# EAGLE design MicroMod_Processor_Board-nRF52840 (EAGLE 9.5.2)
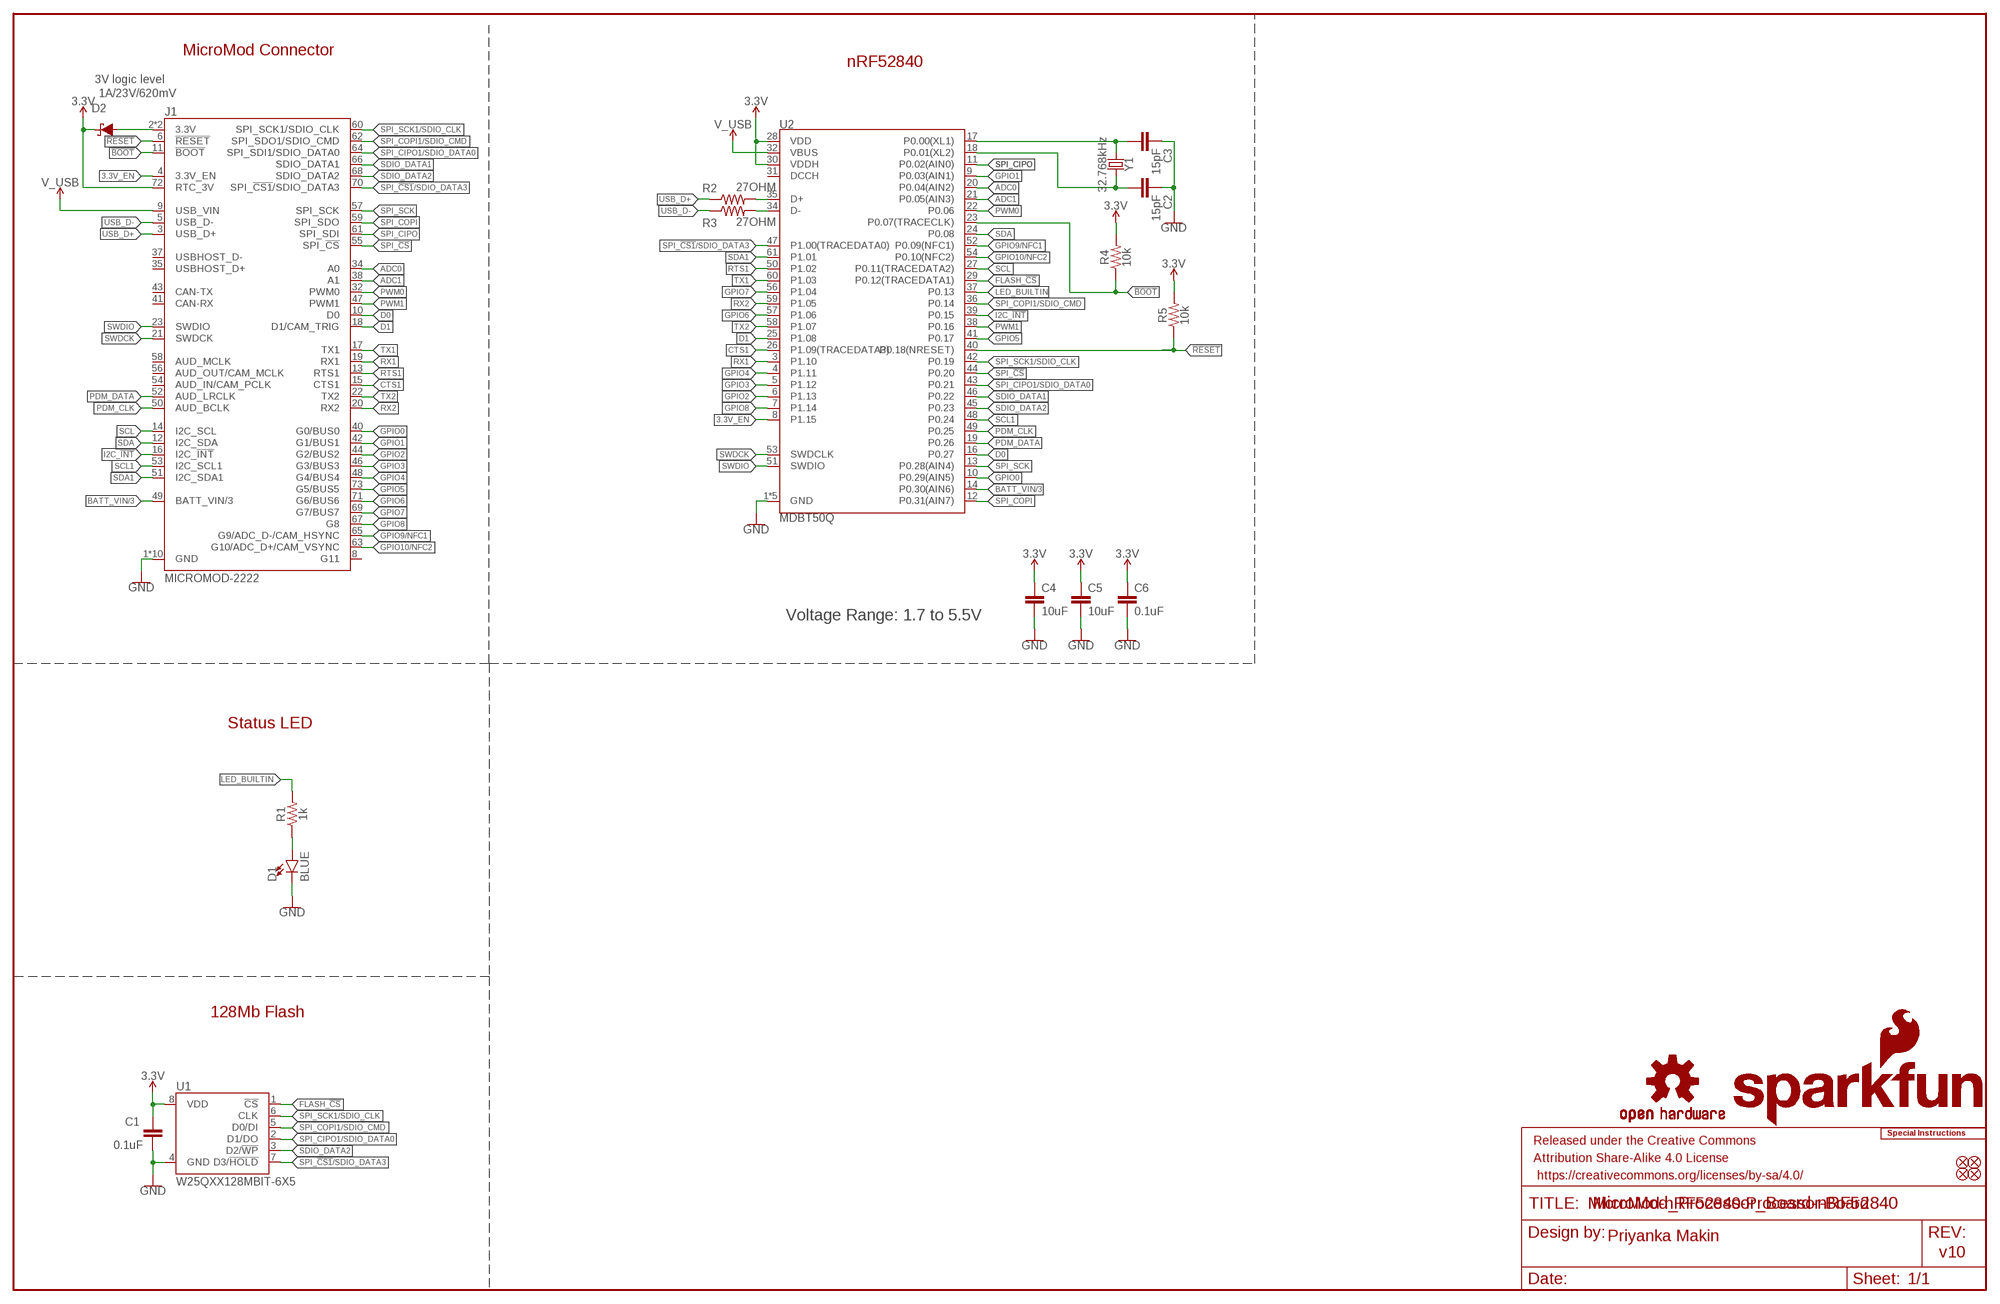
[diagram p0: schematic, sheet 1]

## Parts
C1  0.1uF  0.1UF-0402T-16V-10%  [0402-TIGHT]
C2  15pF  15PF-0402T-50V-5%  [0402-TIGHT]
C3  15pF  15PF-0402T-50V-5%  [0402-TIGHT]
C4  10uF  10UF-0402T-6.3V-20%  [0402-TIGHT]
C5  10uF  10UF-0402T-6.3V-20%  [0402-TIGHT]
C6  0.1uF  0.1UF-0402T-16V-10%  [0402-TIGHT]
D1  BLUE  LED-BLUE0603  [LED-0603]
D2  1A/23V/620mV  DIODE-SCHOTTKY-BAT20J  [SOD-323]
FD1  FIDUCIALUFIDUCIAL  [FIDUCIAL-MICRO]
FD2  FIDUCIALUFIDUCIAL  [FIDUCIAL-MICRO]
FD3  FIDUCIALUFIDUCIAL  [FIDUCIAL-MICRO]
FD4  FIDUCIALUFIDUCIAL  [FIDUCIAL-MICRO]
FRAME1  FRAME-LEDGER  [CREATIVE_COMMONS]
J1  MICROMOD-2222  [M.2-CARD-E-22]
LOGO1  SFE_LOGO_NAME_FLAME.1_INCH  [SFE_LOGO_NAME_FLAME_.1]
LOGO2  SFE_LOGO_FLAME.1_INCH  [SFE_LOGO_FLAME_.1]
LOGO3  OSHW-LOGOMINI  [OSHW-LOGO-MINI]
LOGO4  SPECIAL_INSTRUCTIONS-ORDERING  [ORDERING_INSTRUCTIONS]
R1  1k  1KOHM-0402T-1/16W-1%  [0402-TIGHT]
R2  27OHM  [0402-TIGHT]
R3  27OHM  [0402-TIGHT]
R4  10k  10KOHM-0402T-1/16W-1%  [0402-TIGHT]
R5  10k  10KOHM-0402T-1/16W-1%  [0402-TIGHT]
U1  W25QXX128MBIT-6X5  [WSON-8-6X5]
U2  MDBT50Q  [MDBT50Q]
Y1  32.768kHz  CRYSTAL-32.768KHZSMD-3.2X1.5  [CRYSTAL-SMD-3.2X1.5MM]

## Nets
3.3V: C1.1 C4.1 C5.1 C6.1 D2.C J1.72(RTC_3V) R4.2 R5.2 U1.8(VDD) U2.28(VDD) U2.30(VDDH)
3.3V_EN: J1.4(3.3V_EN) U2.8(P1.15)
!BOOT!: J1.11(!BOOT!) R4.1 U2.23(P0.07(TRACECLK))
!RESET!: J1.6(!RESET!) R5.1 U2.40(P0.18(NRESET))
ADC0: J1.34(A0) U2.20(P0.04(AIN2))
ADC1: J1.38(A1) U2.21(P0.05(AIN3))
BATT_VIN/3: J1.49(BATT_VIN/3) U2.14(P0.30(AIN6))
CTS1: J1.15(CTS1) U2.26(P1.09(TRACEDATA3))
D0: J1.10(D0) U2.16(P0.27)
D1: J1.18(D1/CAM_TRIG) U2.25(P1.08)
FLASH_!CS!: U1.1(!CS!) U2.29(P0.12(TRACEDATA1))
GND: C1.2 C2.1 C3.1 C4.2 C5.2 C6.2 D1.C J1.1(GND) J1.7(GND) J1.33(GND) J1.36(GND) J1.39(GND) J1.45(GND) J1.75(GND) J1.GND1(GND) J1.GND2(GND) J1.GND3(GND) U1.4(GND) U2.1(GND) U2.2(GND) U2.15(GND) U2.33(GND) U2.55(GND)
GPIO0: J1.40(G0/BUS0) U2.10(P0.29(AIN5))
GPIO1: J1.42(G1/BUS1) U2.9(P0.03(AIN1))
GPIO2: J1.44(G2/BUS2) U2.6(P1.13)
GPIO3: J1.46(G3/BUS3) U2.5(P1.12)
GPIO4: J1.48(G4/BUS4) U2.4(P1.11)
GPIO5: J1.73(G5/BUS5) U2.41(P0.17)
GPIO6: J1.71(G6/BUS6) U2.57(P1.06)
GPIO7: J1.69(G7/BUS7) U2.56(P1.04)
GPIO8: J1.67(G8) U2.7(P1.14)
GPIO9/NFC1: J1.65(G9/ADC_D-/CAM_HSYNC) U2.52(P0.09(NFC1))
GPIO10/NFC2: J1.63(G10/ADC_D+/CAM_VSYNC) U2.54(P0.10(NFC2))
I2C_!INT!: J1.16(I2C_!INT!) U2.39(P0.15)
LED_BUILTIN: R1.2 U2.37(P0.13)
N$1: R2.2 U2.35(D+)
N$2: D1.A R1.1
N$3: R3.2 U2.34(D-)
N$4: C3.2 U2.17(P0.00(XL1)) Y1.P$1
N$5: D2.A J1.2(3.3V) J1.74(3.3V)
N$6: C2.2 U2.18(P0.01(XL2)) Y1.P$2
PDM_CLK: J1.50(AUD_BCLK) U2.49(P0.25)
PDM_DATA: J1.52(AUD_LRCLK) U2.19(P0.26)
PWM0: J1.32(PWM0) U2.22(P0.06)
PWM1: J1.47(PWM1) U2.38(P0.16)
RTS1: J1.13(RTS1) U2.50(P1.02)
RX1: J1.19(RX1) U2.3(P1.10)
RX2: J1.20(RX2) U2.59(P1.05)
SCL: J1.14(I2C_SCL) U2.27(P0.11(TRACEDATA2))
SCL1: J1.53(I2C_SCL1) U2.48(P0.24)
SDA: J1.12(I2C_SDA) U2.24(P0.08)
SDA1: J1.51(I2C_SDA1) U2.61(P1.01)
SDIO_DATA1: J1.66(SDIO_DATA1) U2.46(P0.22)
SDIO_DATA2: J1.68(SDIO_DATA2) U1.3(D2/!WP!) U2.45(P0.23)
SPI_!CS1!/SDIO_DATA3: J1.70(SPI_!CS1!/SDIO_DATA3) U1.7(D3/!HOLD!) U2.47(P1.00(TRACEDATA0))
SPI_!CS!: J1.55(SPI_!CS!) U2.44(P0.20)
SPI_CIPO: J1.61(SPI_SDI) U2.11(P0.02(AIN0))
SPI_CIPO1/SDIO_DATA0: J1.64(SPI_SDI1/SDIO_DATA0) U1.2(D1/DO) U2.43(P0.21)
SPI_COPI: J1.59(SPI_SDO) U2.12(P0.31(AIN7))
SPI_COPI1/SDIO_CMD: J1.62(SPI_SDO1/SDIO_CMD) U1.5(D0/DI) U2.36(P0.14)
SPI_SCK: J1.57(SPI_SCK) U2.13(P0.28(AIN4))
SPI_SCK1/SDIO_CLK: J1.60(SPI_SCK1/SDIO_CLK) U1.6(CLK) U2.42(P0.19)
SWDCK: J1.21(SWDCK) U2.53(SWDCLK)
SWDIO: J1.23(SWDIO) U2.51(SWDIO)
TX1: J1.17(TX1) U2.60(P1.03)
TX2: J1.22(TX2) U2.58(P1.07)
USB_D+: J1.3(USB_D+) R2.1
USB_D-: J1.5(USB_D-) R3.1
V_USB: J1.9(USB_VIN) U2.32(VBUS)
Unconnected: J1.8(G11) J1.35(USBHOST_D+) J1.37(USBHOST_D-) J1.41(CAN-RX) J1.43(CAN-TX) J1.54(AUD_IN/CAM_PCLK) J1.56(AUD_OUT/CAM_MCLK) J1.58(AUD_MCLK) U2.31(DCCH)

## Notes on the sheet
- MicroMod Connector
- nRF52840
- 3V logic level
- Voltage Range: 1.7 to 5.5V
- Status LED
- 128Mb Flash
- MicroMod-nRF52840-Processor-Board
- Priyanka Makin
- v10

## Library data of the parts
C1 C6 = SparkFun-Capacitors:0.1UF: 0.1µF ceramic capacitors A capacitor is a passive two-terminal electrical component used to store electrical energy temporarily in an electric field.; PROD_ID: CAP-12416
C2 C3 = SparkFun-Capacitors:15PF: 15pF ceramic capacitors A capacitor is a passive two-terminal electrical component used to store electrical energy temporarily in an electric field.; PROD_ID: CAP-13063
C4 C5 = SparkFun-Capacitors:10UF: 10.0µF ceramic capacitors A capacitor is a passive two-terminal electrical component used to store electrical energy temporarily in an electric field.; PROD_ID: CAP-14848
D1 = SparkFun-LED:LED-BLUE: Blue SMD LED Used in manufacturing of various products at SparkFun Packages: 0603 - SMD 0603 package [Product Link] <http://www.digikey.com/product-detail/en/SMLE12BC7TT86/511-1589-2-ND/1641808> 1206 - SMD1206 package [Product Link] <http://www.digikey.com/product-detail/en/lite-on-inc/LTST-C150TBKT/160-1643-1-ND/573584> SparkFun Products: ESP8266 Thing-Dev Board <https://www.sparkfun.com/products/13711> RedBoard <https://www.sparkfun.com/products/12757>; PROD_ID: DIO-08575
D2 = SparkFun-DiscreteSemi:DIODE-SCHOTTKY: Schottky diode A Schottky diode is a semiconductor diode which has a low forward voltage drop and a very fast switching action.; PROD_ID: DIO-11623
FD1-FD4 = SparkFun-Aesthetics:FIDUCIAL: Fiducial Alignment Points Point-of-reference for pick-and-place machines and other optical instruments.
FRAME1 = SparkFun-Aesthetics:FRAME-LEDGER: Schematic Frame - Ledger Standard 11x14 US Ledger frame
J1 = SparkFun-MicroMod:MICROMOD: MicroMod Connector Description: A card edge connector and mating PCB connector to allow various MicroMod Processor Boards to be coupled with various carrier boards of different capabilities. Based on the M.2 standard.
LOGO1 = SparkFun-Aesthetics:SFE_LOGO_NAME_FLAME: SparkFun Font Logo w/ Flame This is the SparkFun full logo. The logo on the schematic will always be the same size; the package variant is the height of the flame part of the logo. Default layer for the logo on the board is tSilk.
LOGO2 = SparkFun-Aesthetics:SFE_LOGO_FLAME: SparkFun Flame Logo This is the SparkFun flame logo. The logo on the schematic will always be the same size; the package variant is the height of the flame. Default layer for the logo on the board is tSilk.
LOGO3 = SparkFun-Aesthetics:OSHW-LOGO: Open-Source Hardware (OSHW) Logo This logo indicates the piece of hardware it is found on incorporates a OSHW license and/or adheres to the definition of open source hardware found here: http://freedomdefined.org/OSHW
LOGO4 = SparkFun-Aesthetics:SPECIAL_INSTRUCTIONS: Special Ordering/Production Instructions Alert Symbol for special PCB ordering instructions or unique production process warnings. Ordering Instructions Production Instructions Types of information that should be added to box: Copper weight Soldermask color Silk color PCB thickness Number of layers PCB Standard: 1.6mm FR4 1 oz copper immersion silver plating red soldermask white silkscreen Types of information that should be added to box: Special wash requirements Depaneling instructions Humidification Glue curing Default text settings: 0.07 inch 9% ratio 50% line distance
R1 = SparkFun-Resistors:1KOHM: 1kΩ resistor A resistor is a passive two-terminal electrical component that implements electrical resistance as a circuit element. Resistors act to reduce current flow, and, at the same time, act to lower voltage levels within circuits. - Wikipedia; PROD_ID: RES-14342
R2 R3 = SparkFun-Resistors:27OHM: 27Ω resistor A resistor is a passive two-terminal electrical component that implements electrical resistance as a circuit element. Resistors act to reduce current flow, and, at the same time, act to lower voltage levels within circuits. - Wikipedia; PROD_ID: RES-15238
R4 R5 = SparkFun-Resistors:10KOHM: 10kΩ resistor A resistor is a passive two-terminal electrical component that implements electrical resistance as a circuit element. Resistors act to reduce current flow, and, at the same time, act to lower voltage levels within circuits. - Wikipedia; PROD_ID: RES-14241
U1 = SparkFun-MicroMod:W25QXX; PROD_ID: IC-15107
U2 = SparkFun-RF:MDBT50Q; PROD_ID: IC-14109
Y1 = SparkFun-Clocks:CRYSTAL-32.768KHZ: 32.768kHz Crystal Frequency: 32.768kHz Frequency Stability: ±20ppm Load Capacitance: 12.5pF (PTH-2X6 & SMD-3.2X1.5), 6pF (SMD-2X6) SparkFun Products: SparkFun BigTime Watch Kit <https://www.sparkfun.com/products/11734> SparkFun nRF52832 Breakout <https://www.sparkfun.com/products/13990> SparkFun Real Time Clock Module <https://www.sparkfun.com/products/12708>; PROD_ID: XTAL-13062

## Net classes
0 default: width 0 mm, drill 0 mm

## Board
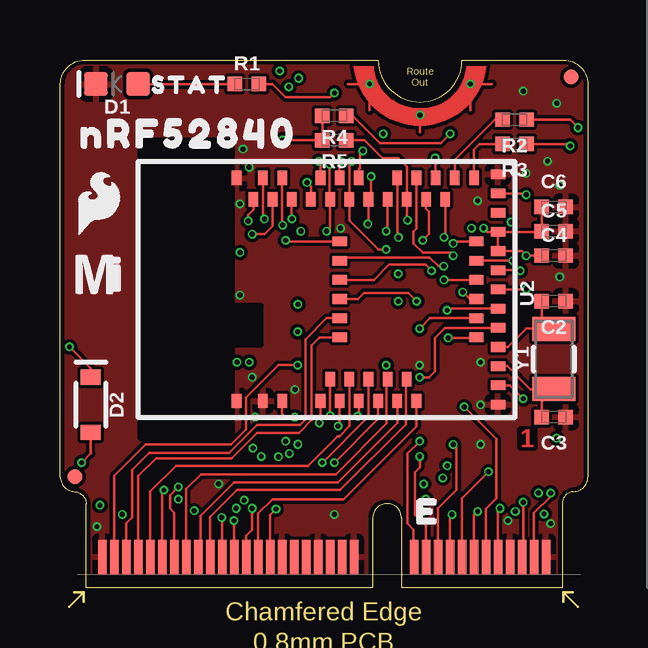
[diagram p1: board, top side]
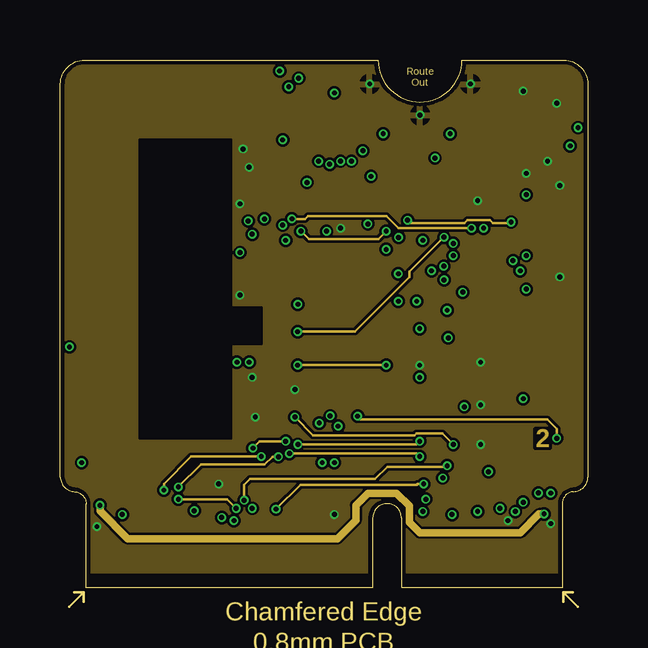
[diagram p2: board, inner layer Horz]
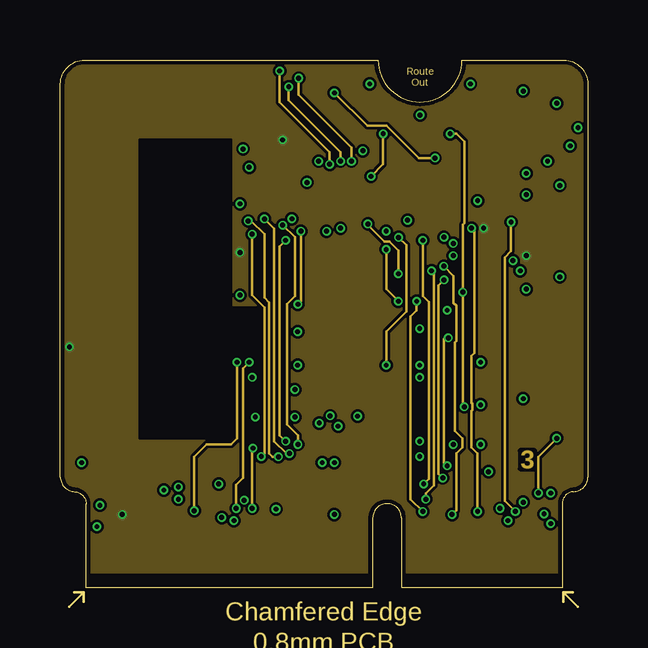
[diagram p3: board, inner layer Vert]
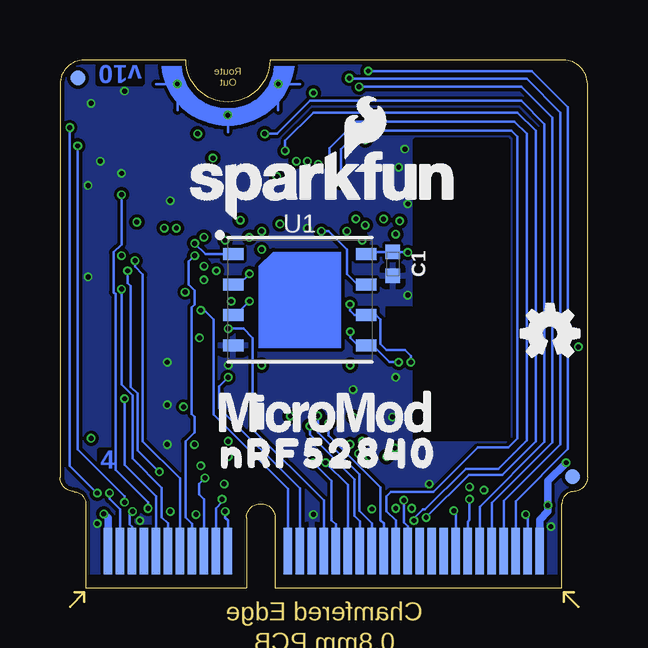
[diagram p4: board, bottom side, seen from below]

Size 22 x 22 mm. Coordinates in mm from the lower left corner, seen from the top.
Outline: 0,4.6 0,21 arc-87 1,22 13.25,22 arc180 16.75,22 21,22 arc-87 22,21 22,4.6
Outline: 0,4.6 arc87 0.6,4
Outline: 21.4,4 arc87 22,4.6
Outline: 21.4,4 arc85 20.93,3.5 20.93,0 14.22,0 14.22,2.9 arc180 13.03,2.9 13.03,0 1.07,0 1.07,3.5 arc84 0.6,4
Outline: 21.4,4 arc87 22,4.6
Outline: 0,4.6 arc87 0.6,4
Copper layers (1+2*15+16): Top 0.035mm / dielectric 1.5mm / Horz 0.035mm / dielectric 0.15mm / Vert 0.035mm / dielectric 0.2mm / Bottom 0.035mm
Design rules "SparkFun-4-layer-MicroMod": minimum track width 4mil, minimum drill 0.2mm, track to track 4mil, track to pad 4mil, pad to pad 4mil, via to via 4mil, smd to smd 4mil, copper to edge 6mil, drill to drill 6mil, minimum pad ring 3mil, minimum via ring 3mil, stop-mask expansion 4mil, vias tented up to drill 25mil, thermal gap 10mil

### Footprints (pad centres in the part's own frame; a part is rotated, then mirrored left to right if it is on the bottom)
0402-TIGHT = smd 0.6 x 0.6: 1 -0.5,0; 2 0.5,0
LED-0603 = smd 1 x 1: A -0.877,0; C 0.877,0
SOD-323 = smd 0.63 x 0.83: A 1.15,0; C -1.15,0
FIDUCIAL-MICRO = smd 0.635 x 0.635: 1 0,0
M.2-CARD-E-22 = smd 0.35 x 1.45: 1 9.25,1.275; 3 8.75,1.275; 5 8.25,1.275; 7 7.75,1.275; 9 7.25,1.275; 11 6.75,1.275; 13 6.25,1.275; 15 5.75,1.275; 17 5.25,1.275; 19 4.75,1.275; 21 4.25,1.275; 23 3.75,1.275; 33 1.25,1.275; 35 0.75,1.275; 37 0.25,1.275; 39 -0.25,1.275; 41 -0.75,1.275; 43 -1.25,1.275; 45 -1.75,1.275; 47 -2.25,1.275; 49 -2.75,1.275; 51 -3.25,1.275; 53 -3.75,1.275; 55 -4.25,1.275; 57 -4.75,1.275; 59 -5.25,1.275; 61 -5.75,1.275; 63 -6.25,1.275; 65 -6.75,1.275; 67 -7.25,1.275; 69 -7.75,1.275; 71 -8.25,1.275; 73 -8.75,1.275; 75 -9.25,1.275 | smd 0.35 x 1.95 bottom: 2 9,1.525; 4 8.5,1.525; 6 8,1.525; 8 7.5,1.525; 10 7,1.525; 12 6.5,1.525; 14 6,1.525; 16 5.5,1.525; 18 5,1.525; 20 4.5,1.525; 22 4,1.525; 32 1.5,1.525; 34 1,1.525; 36 0.5,1.525; 38 0,1.525; 40 -0.5,1.525; 42 -1,1.525; 44 -1.5,1.525; 46 -2,1.525; 48 -2.5,1.525; 50 -3,1.525; 52 -3.5,1.525; 54 -4,1.525; 56 -4.5,1.525; 58 -5,1.525; 60 -5.5,1.525; 62 -6,1.525; 64 -6.5,1.525; 66 -7,1.525; 68 -7.5,1.525; 70 -8,1.525; 72 -8.5,1.525; 74 -9,1.525 | drill 0.2: GND1 1.9,21; GND2 4,19.7; GND3 6.1,21
WSON-8-6X5 = smd 0.85 x 0.5: 1 -2.775,1.905; 2 -2.775,0.635; 3 -2.775,-0.635; 4 -2.775,-1.905; 5 2.775,-1.905; 6 2.775,-0.635; 7 2.775,0.635; 8 2.775,1.905
MDBT50Q = smd 0.6 x 0.4: 1 -4.65,3.65; 2 -4.65,2.55; 3 -4.65,1.75; 4 -4.65,0.15; 5 -3.75,-0.25; 6 -4.65,-0.65; 7 -3.75,-1.05; 8 -4.65,-1.45; 9 -3.75,-1.85; 10 -4.65,-2.25; 11 -3.75,-2.65; 12 -4.65,-3.05; 13 -3.75,-3.45; 14 -4.65,-3.85; 34 4.65,-6.25; 35 4.65,-5.45; 36 3.75,-5.05; 37 4.65,-4.65; 38 3.75,-4.25; 39 4.65,-3.85; 40 3.75,-3.45; 41 4.65,-3.05; 42 3.75,-2.65; 43 3.75,-1.85; 44 4.65,-1.45; 45 3.75,-1.05; 46 4.65,-0.65; 47 3.75,-0.25; 48 4.65,0.15; 49 3.75,0.55; 50 3.75,1.35; 51 4.65,1.75; 52 3.75,2.15; 53 4.65,2.55; 54 3.75,2.95; 55 4.65,3.65 | smd 0.4 x 0.6: 15 -4.8,-7.25; 16 -4,-7.25; 17 -3.2,-7.25; 18 -2.4,-7.25; 19 -2,-6.35; 20 -1.6,-7.25; 21 -1.2,-6.35; 22 -0.8,-7.25; 23 -0.4,-6.35; 24 0,-7.25; 25 0.4,-6.35; 26 0.8,-7.25; 27 1.2,-6.35; 28 1.6,-7.25; 29 2,-6.35; 30 2.4,-7.25; 31 3.2,-7.25; 32 4,-7.25; 33 4.8,-7.25; 56 -2,-0.65; 57 -1.2,-0.65; 58 -0.4,-0.65; 59 0.4,-0.65; 60 1.2,-0.65; 61 2,-0.65
CRYSTAL-SMD-3.2X1.5MM = smd 1 x 1.8: P$1 -1.25,0; P$2 1.25,0

### Placement (x,y rotation side)
C1  8.12,13.49 270 bottom
C2  20.57,11.94 180 top
C3  20.57,7.11 180 top
C4  20.57,13.84 0 top
C5  20.57,14.86 0 top
C6  20.57,15.88 0 top
D1  2.37,21 180 top
D2  1.27,7.62 270 top
FD1  0.62,4.62 0 top
FD2  21.3,21.3 0 top
FD3  21.25,21.25 0 bottom
FD4  0.62,4.62 0 bottom
FRAME1  -8.89,-8.89 0 top  (outside the outline)
J1  11,0 0 top
LOGO1  11,16.79 0 bottom
LOGO2  1.6,16.03 0 top
LOGO3  1.56,10.61 0 bottom
LOGO4  24.54,50.8 0 top  (outside the outline)
R1  7.78,21 0 top
R2  18.94,19.51 180 top
R3  18.94,18.49 180 top
R4  11.43,19.67 180 top
R5  11.43,18.65 180 top
U1  12,12 0 bottom
U2  11,12.43 90 top
U$1  [MICROMOD_MI_LOGO_.35]  1.55,13.08 0 top
U$2  [STAT0]  5.4,20.95 0 top
U$3  [NRF528400]  10.79,5.59 0 bottom
U$5  [MICROMOD_LOGO_.35]  11,7.3 0 bottom
U$6  [NRF528400]  5.33,18.92 0 top
Y1  20.57,9.53 90 top

### Tracks (layer width: path | path; a pad name or v marks a point on that pad's centre or on a via)
3.3V  (via drill 0.2)
  Top 0.102: U2.30 20.05,14.83 C5.1 C6.1 | C4.1 v19.43,13.84 19.24,14.03 U2.28 U2.30 | R4.2 R5.2 9.29,18.65 v9.27,18.67 | U2.30 17.81,14.83 v17.65,14.99 | D2.C 1.27,9.14 v0.38,10.03
  Bottom 0.102: U1.8 9.14,13.99 C1.1 7.52,13.99 v7.49,13.97 | J1.72 2.5,2.97 v2.58,3.05
  pour Vert (isolate 0.102): 0,22 22,22 22,0.64 0,0.64
  cutout Vert (isolate 0.305): 3.3,18.67 7.11,18.67 7.11,11.68 8.38,11.68 8.38,10.16 7.11,10.16 7.11,6.22 3.3,6.22
3.3V_EN  (via drill 0.2)
  Top 0.102: v12.39,7.15 12.39,7.22 12.45,7.27 U2.8
  Horz 0.102: v12.39,7.15 12.52,7.02 20.3,7.02 20.7,6.62 v20.7,6.22
  Vert 0.102: v19.93,3.94 19.93,5.46 v20.7,6.22
  Bottom 0.102: J1.4 19.5,3.26 19.93,3.69 v19.93,3.94
!BOOT!  (via drill 0.2)
  Top 0.102: R4.1 12.18,19.67 13.32,18.53 15.86,18.53 v16.26,18.92 | v16.85,7.54 18.19,6.2 18.19,3.71 17.75,3.27 J1.11 | U2.23 17.07,12.03 v16.78,12.32
  Vert 0.102: v16.85,7.54 16.78,7.6 v16.78,12.32 16.78,15.14 16.84,15.2 16.84,18.59 16.51,18.92 v16.26,18.92
!RESET!  (via drill 0.2)
  Top 0.102: R5.1 12.69,18.65 13.44,17.91 14.1,17.91 14.45,17.55 U2.40 14.45,15.34 v14.48,15.32
  Horz 0.102: v18.8,15.24 18.75,15.19 18.03,15.19 17.91,15.32 16.97,15.32 16.84,15.19 14.61,15.19 v14.48,15.32
  Vert 0.102: v18.8,15.24 18.8,14.02 18.54,13.77 18.54,3.61 v18.97,3.17
  Bottom 0.102: v18.97,3.17 19.1,3.05 19.1,2.64 19,2.54 J1.6
ADC0  (via drill 0.2)
  Top 0.102: U2.20 16.04,10.83 15.62,10.41 15.62,9.02 15.37,8.76 v14.99,8.76
  Bottom 0.102: v14.99,8.76 15.37,8.38 15.37,7.49 12,4.13 J1.34
ADC1  (via drill 0.2)
  Top 0.102: U2.21 15.42,11.23 v14.99,10.79
  Bottom 0.102: v14.99,10.79 14.35,10.79 13.97,10.41 13.97,6.6 11,3.63 J1.38
BATT_VIN/3
  Top 0.102: U2.14 14.85,6.72 11.81,3.68 8.85,3.68 8.25,3.08 J1.49
CTS1  (via drill 0.2)
  Top 0.102: U2.26 19.16,13.23 v19.18,13.21 | J1.15 16.75,3.72 v17.86,4.83
  Bottom 0.102: v19.18,13.21 19.18,12.7 19.05,12.57 19.05,8.37 18.77,8.1 18.77,5.72 17.87,4.83 v17.86,4.83
D0  (via drill 0.2)
  Top 0.102: U2.16 18.75,8.43 v19.3,7.87
  Bottom 0.102: v19.3,7.87 19.3,5.12 18,3.81 J1.10
D1  (via drill 0.2)
  Top 0.102: U2.25 v16,12.83
  Vert 0.102: v15.95,4.57 15.77,4.75 15.77,12.6 v16,12.83
  Bottom 0.102: v15.95,4.57 16.2,4.32 16.2,3.89 16,3.68 J1.18
FLASH_!CS!  (via drill 0.2)
  Top 0.102: v16.38,14.35 16.46,14.43 U2.29
  Bottom 0.102: U1.1 15.94,13.9 v16.38,14.35
GND  (via drill 0.2)
  other vias: 7.62,18.29 14.99,9.27 11.43,3.05 20.45,2.67 18.67,2.79 7.49,12.19 20.83,16.76 20.83,12.95 19.43,17.27 17.53,7.62 7.87,17.53 19.3,20.7 20.7,20.19 20.32,17.78 1.52,2.54 6.6,4.32 17.53,5.97 17.53,9.4 8.13,7.11 7.49,16 11.68,14.99 17.4,16.13 9.78,8.26 8,8.76
  pour Top (isolate 0.14): 0,22 22,22 22,0.6 0,0.6
  pour Bottom (isolate 0.14): 0,22 22,22 22,0.6 0,0.6
  pour Horz (isolate 0.102): 0,0.64 0,22 22,22 22,0.64
  cutout Top (isolate 0.305): 3.3,18.67 7.11,18.67 7.11,11.68 8.38,11.68 8.38,10.16 7.11,10.16 7.11,6.22 3.3,6.22
  cutout Top (isolate 0.305): 3.3,18.67 7.11,18.67 7.11,11.68 8.38,11.68 8.38,10.16 7.11,10.16 7.11,6.22 3.3,6.22
  cutout Horz (isolate 0.305): 3.3,18.67 7.11,18.67 7.11,11.68 8.38,11.68 8.38,10.16 7.11,10.16 7.11,6.22 3.3,6.22
  cutout Bottom (isolate 0.305): 3.3,18.67 7.11,18.67 7.11,11.68 8.38,11.68 8.38,10.16 7.11,10.16 7.11,6.22 3.3,6.22
GPIO0  (via drill 0.2)
  Top 0.102: U2.10 13.25,7.03 v11.43,5.21
  Bottom 0.102: v11.43,5.21 10.67,4.45 10.67,2.79 10.5,2.63 J1.40
GPIO1  (via drill 0.2)
  Top 0.102: U2.9 12.85,7.13 v10.92,5.21
  Bottom 0.102: v10.92,5.21 10,4.29 J1.42
GPIO2  (via drill 0.2)
  Top 0.102: U2.6 11.65,6.8 v11.58,6.73
  Bottom 0.102: v11.58,6.73 11.58,6.38 9.71,4.51 9.71,2.98 9.5,2.77 J1.44
GPIO3  (via drill 0.2)
  Top 0.102: U2.5 v11.25,7.16
  Bottom 0.102: v11.25,7.16 11.25,6.46 9.51,4.72 9.51,3.19 9,2.68 J1.46
GPIO4  (via drill 0.2)
  Top 0.102: U2.4 10.85,6.91 v10.79,6.86
  Bottom 0.102: J1.48 8.5,2.67 8.63,2.79 8.63,4.18 10.79,6.35 v10.79,6.86
GPIO5  (via drill 0.2)
  Top 0.102: J1.73 2.25,4.66 3.56,5.97 7.11,5.97 7.75,6.6 7.75,7.92 9.1,9.27 v9.89,9.27 | v14.1,14.6 14.05,14.65 U2.41
  Horz 0.102: v9.89,9.27 v13.59,9.27
  Vert 0.102: v13.59,9.27 13.59,10.67 14.43,11.51 14.43,14.28 v14.1,14.6
GPIO6
  Top 0.102: J1.71 2.75,2.67 3,2.93 3,4.91 3.71,5.61 7.04,5.61 8.21,6.78 9.99,6.78 10.22,7.01 10.22,10.35 11.1,11.23 U2.57
GPIO7
  Top 0.102: J1.69 3.25,4.65 3.99,5.38 7.13,5.38 8.2,6.45 9.95,6.45 10.48,6.98 10.48,10.1 10.81,10.43 U2.56
GPIO8
  Top 0.102: J1.67 3.75,4 4.83,5.08 10.33,5.08 11.55,6.3 11.63,6.3 12.06,6.73 12.06,8.66 U2.7
GPIO9/NFC1  (via drill 0.2)
  Top 0.102: U2.52 8.85,15.07 8.51,14.73 v8,14.73 | J1.65 4.25,4 v4.32,4.06
  Horz 0.102: v4.32,4.06 4.32,4.32 5.46,5.46 v8.38,5.46
  Vert 0.102: v8,14.73 8,12.19 8.51,11.68 8.51,5.59 v8.38,5.46
GPIO10/NFC2  (via drill 0.2)
  Top 0.102: U2.54 8.05,15.76 7.83,15.54 v7.83,15.28 | J1.63 4.75,3.12 4.57,3.3 4.57,3.84 v4.92,4.19
  Horz 0.102: v9.09,5.45 8.84,5.45 8.52,5.13 5.86,5.13 v4.92,4.19
  Vert 0.102: v7.83,15.28 7.96,15.28 8.51,14.73 8.51,12.1 8.71,11.89 8.71,5.59 8.85,5.45 v9.09,5.45
I2C_!INT!  (via drill 0.2)
  Top 0.102: v16.38,13.84 16.26,13.97 15.11,13.97 14.73,14.35 14.73,14.85 14.86,14.98 U2.39
  Bottom 0.102: J1.16 16.5,2.66 16.76,2.92 16.76,6.1 16.38,6.48 16.38,7.11 16.51,7.24 16.51,11.68 16.38,11.81 16.38,12.39 16.64,12.64 16.64,13.59 v16.38,13.84
LED_BUILTIN  (via drill 0.2)
  Top 0.102: R1.2 8.85,21 9.4,20.45 11.25,20.45 v11.43,20.62 | v15.62,17.91 15.65,17.88 U2.37
  Vert 0.102: v11.43,20.62 12.8,19.25 13.6,19.25 14.95,17.91 v15.62,17.91
N$1
  Top 0.102: R2.2 18.11,19.51 16.45,17.85 U2.35
N$2
  Top 0.102: D1.A R1.1
N$3
  Top 0.102: R3.2 17.48,18.49 17.25,18.27 U2.34
N$4
  Top 0.102: U2.17 18.63,9.23 19.61,8.26 20.55,8.26 Y1.P$1 20.07,7.78 C3.2
N$5  (via drill 0.2)
  Top 0.102: v0.89,5.21 1.27,5.59 D2.A
  Horz 0.305: v20.17,3.07 19.96,3.07 19.18,2.29 14.99,2.29 14.55,2.72 14.55,3.4 14.02,3.94 12.83,3.94 12.32,3.43 12.32,2.79 11.56,2.03 2.81,2.03 1.65,3.19 v1.65,3.43
  Bottom 0.305: v0.89,5.21 1.65,4.45 v1.65,3.43 1.65,3.17 2,2.83 J1.74 | J1.2 20,2.9 v20.17,3.07
N$6
  Top 0.102: U2.18 18.67,10.03 19.43,10.79 20.55,10.79 Y1.P$2 20.07,11.28 C2.2
PDM_CLK  (via drill 0.2)
  Top 0.102: U2.49 10.45,16.73 v10.29,16.89
  Bottom 0.102: v10.29,16.89 10.29,18.29 9.53,19.05 3.17,19.05 2.92,18.8 2.92,6.22 3.3,5.84 4.57,5.84 6.43,3.99 8.2,3.99 8.38,3.81 8.38,3.17 8,2.79 J1.50
PDM_DATA  (via drill 0.2)
  Top 0.102: v16.18,10.41 17.33,10.41 U2.19
  Horz 0.102: v7.66,3.64 7.66,4.28 7.92,4.53 13.12,4.53 13.63,5.04 15.96,5.04 16,5.08 v16.13,5.08
  Vert 0.102: v16.13,5.08 16,5.21 16,10.36 16.05,10.41 v16.18,10.41
  Bottom 0.102: J1.52 7.5,2.55 7.66,2.71 v7.66,3.64
PWM0  (via drill 0.2)
  Top 0.102: v16.13,11.56 16.2,11.63 U2.22
  Bottom 0.102: J1.32 12.5,4.12 15.6,7.21 15.6,11.19 15.97,11.56 v16.13,11.56
PWM1  (via drill 0.2)
  Top 0.102: U2.38 15.25,15.8 15.38,15.67 15.38,14.74 v15.11,14.48 | J1.47 8.75,3.03 v8.99,3.27
  Horz 0.102: v8.99,3.27 10.01,4.29 14.87,4.29 14.89,4.32 v15.15,4.32
  Vert 0.102: v15.15,4.32 15.37,4.54 15.37,11.9 15.11,12.15 v15.11,14.48
RTS1  (via drill 0.2)
  Top 0.102: J1.13 17.25,3.03 v17.4,3.17 | v9.66,15.37 9.65,15.38 U2.50
  Horz 0.102: v9.66,15.37 10.2,15.37 10.33,15.49 13.6,15.49 14.11,14.99 v17.14,14.99
  Vert 0.102: v17.14,14.99 17.27,14.86 17.27,9.78 17.14,9.65 17.14,7.71 17.18,7.67 17.18,7.4 17.14,7.37 17.14,5.84 17.4,5.59 v17.4,3.17
RX1  (via drill 0.2)
  Top 0.102: v16.39,5.96 16.52,5.84 16.52,4.07 15.75,3.31 J1.19 | v9.78,7.11 9.4,7.11 9.25,7.26 U2.3
  Horz 0.102: v16.39,5.96 15.93,6.43 14.85,6.43 14.77,6.35 10.54,6.35 v9.78,7.11
RX2  (via drill 0.2)
  Top 0.102: U2.59 13.07,12.83 13.7,13.46 15.22,13.46 v15.48,13.21
  Vert 0.102: v15.48,13.21 15.57,13.12 15.57,4.27 15.24,3.94 v15.24,3.68
  Bottom 0.102: v15.24,3.68 15.24,3.56 15.5,3.3 J1.20
SCL  (via drill 0.2)
  Top 0.102: v18.87,13.63 U2.27
  Bottom 0.102: J1.14 17,4.55 18.54,6.1 18.54,13.05 18.87,13.38 v18.87,13.63
SCL1  (via drill 0.2)
  Top 0.102: J1.53 v7.25,2.78 v7.24,2.79 | U2.48 10.85,17.7 v10.77,17.78
  Bottom 0.102: v10.77,17.78 10.77,18.31 9.65,19.43 3.05,19.43 2.54,18.92 2.54,6.13 3.72,4.95 5.08,4.95 6.78,3.25 6.87,3.25 7.24,2.88 v7.24,2.79
SDA  (via drill 0.2)
  Top 0.102: U2.24 19.41,12.43 v19.43,12.45
  Bottom 0.102: v19.43,12.45 19.43,8.47 18.97,8.01 18.97,5.38 17.75,4.17 17.75,2.92 17.5,2.67 J1.12
SDA1  (via drill 0.2)
  Top 0.102: U2.61 9.35,14.43 v9.4,14.48 | v8,3.3 8,2.41 7.75,2.16 J1.51
  Horz 0.102: v9.4,6.1 8.31,6.1 v8.03,5.81
  Vert 0.102: v9.4,14.48 9.14,14.22 9.14,6.35 v9.4,6.1 | v8.03,5.81 8,5.79 v8,3.3
SDIO_DATA1  (via drill 0.2)
  Top 0.102: U2.46 11.65,17.75 v11.68,17.78
  Vert 0.102: v11.68,17.78 11.68,18.16 9.53,20.32 v9.53,20.88
  Bottom 0.102: J1.66 4,3.53 1.47,6.05 1.47,19.6 2.75,20.88 v9.53,20.88
SDIO_DATA2  (via drill 0.2)
  Top 0.102: v13.59,14.1 13.26,14.1 12.05,15.31 U2.45 12.05,17.69 v12.14,17.78
  Vert 0.102: v13.59,14.1 13.59,12.45 v14.1,11.94 | v12.14,17.78 12.14,18.34 9.94,20.54 v9.94,21.24
  Bottom 0.102: U1.3 14.67,11.37 v14.1,11.94 | J1.68 3.5,3.61 1.14,5.97 1.14,19.81 2.54,21.21 9.91,21.21 v9.94,21.24
SPI_!CS1!/SDIO_DATA3  (via drill 0.2)
  Top 0.102: v11.23,17.65 11.23,16.2 U2.47 11.25,15.01 v11.1,14.86
  Vert 0.102: v11.23,17.65 11.23,18.16 9.14,20.24 v9.14,21.54
  Bottom 0.102: U1.7 9.59,12.63 10.03,13.08 10.03,14.1 10.79,14.86 v11.1,14.86 | J1.70 3,3.6 0.81,5.79 0.81,20.02 2.33,21.54 v9.14,21.54
SPI_!CS!  (via drill 0.2)
  Top 0.102: J1.55 6.75,2.9 v6.73,2.92 | v12.61,18.21 12.48,18.09 12.48,17.5 12.45,17.46 U2.44
  Bottom 0.102: v6.73,2.92 4.95,4.7 3.56,4.7 2.16,6.1 2.16,19.05 2.92,19.81 11.43,19.81 12.61,18.63 v12.61,18.21
SPI_CIPO
  Top 0.102: J1.61 5.25,4.11 5.87,4.72 11.49,4.72 13.6,6.84 13.6,8.63 U2.11
SPI_CIPO1/SDIO_DATA0  (via drill 0.2)
  Top 0.102: v12.83,15.16 12.85,15.16 U2.43 12.95,16.28 v12.95,17.14
  Vert 0.102: v13.46,18.92 13.46,17.65 v12.95,17.14 | v14.1,13.08 14.1,14.06 13.73,14.43 13.51,14.43 12.83,15.11 v12.83,15.16
  Bottom 0.102: J1.64 4.5,3.37 1.8,6.07 1.8,19.33 2.77,20.3 11.58,20.3 12.95,18.92 v13.46,18.92 | U1.2 14.54,12.63 v14.1,13.08
SPI_COPI
  Top 0.102: U2.12 14.05,6.87 11.57,4.39 7.24,4.39 5.84,3 5.84,1.37 J1.59
SPI_COPI1/SDIO_CMD  (via drill 0.2)
  Top 0.102: v16,14.61 16.05,14.66 U2.36
  Horz 0.102: v7.33,3.3 | v7.33,3.3 6.95,3.68 v4.92,3.68 | v16,14.61 14.55,13.17 14.55,12.94 12.28,10.67 v9.89,10.67
  Vert 0.102: v7.87,9.4 7.62,9.14 7.62,4.57 7.33,4.29 v7.33,3.3
  Bottom 0.102: v7.87,9.4 8.26,9.4 8.95,10.1 U1.5 9.57,10.1 9.89,10.41 v9.89,10.67 | v4.92,3.68 4.92,2.83 5,2.75 J1.62
SPI_SCK
  Top 0.102: J1.57 6.25,2.95 7.37,4.06 11.66,4.06 14.4,6.81 14.4,8.63 U2.13
SPI_SCK1/SDIO_CLK  (via drill 0.2)
  Top 0.102: U2.42 13.65,14.92 v13.59,14.86
  Horz 0.102: v13.59,14.86 13.26,14.53 10.36,14.53 v10.03,14.86
  Vert 0.102: v10.03,14.86 10.03,11.94 v9.91,11.81 | v5.58,3.2 5.58,5.45 6.1,5.97 7.11,5.97 7.37,6.22 v7.37,9.4
  Bottom 0.102: v9.91,11.81 9.91,11.56 9.71,11.37 U1.6 8.82,11.37 8.64,11.18 8.64,10.16 8.38,9.91 7.62,9.91 7.37,9.65 v7.37,9.4 | J1.60 5.5,3.12 v5.58,3.2
SWDCK  (via drill 0.2)
  Top 0.102: U2.53 8.45,15.43 v8.51,15.37 | v14.99,5.46 14.99,5 14.78,4.8 14.78,3.04 15.25,2.57 J1.21
  Horz 0.102: v14.99,5.46 14.86,5.59 v9.55,5.59
  Vert 0.102: v8.51,15.37 8.91,14.96 8.91,6.1 9.42,5.59 v9.55,5.59
SWDIO  (via drill 0.2)
  Top 0.102: J1.23 14.73,1.29 14.73,2.41 14.48,2.67 14.48,5.59 v14.99,6.1 | U2.51 9.25,15.13 v9.27,15.11
  Horz 0.102: v9.91,5.97 14.86,5.97 v14.99,6.1
  Vert 0.102: v9.27,15.11 9.78,14.61 9.78,12.15 9.45,11.82 9.45,6.81 9.91,6.35 v9.91,5.97
TX1  (via drill 0.2)
  Top 0.102: v16.33,3.05 16.25,2.97 J1.17 | v15.99,13.4 15.76,13.4 15.4,13.76 11.78,13.76 U2.60
  Vert 0.102: v16.33,3.05 16.51,3.23 16.51,5.59 16.76,5.84 16.76,6.22 16.46,6.53 16.46,10.23 16.51,10.28 16.51,11.76 16.4,11.87 16.4,12.99 v15.99,13.4
TX2  (via drill 0.2)
  Top 0.102: U2.58 12.41,12.03 12.67,12.28 14.51,12.28 v14.86,11.94
  Vert 0.102: v14.86,11.94 14.86,11.56 14.61,11.3 14.61,3.68 v15.11,3.17
  Bottom 0.102: J1.22 15,2.79 15.11,2.91 v15.11,3.17
USB_D+  (via drill 0.2)
  Top 0.102: v21.59,19.18 21.26,19.51 R2.1 | v20.45,3.94 20.45,3.81 19.75,3.11 J1.3
  Bottom 0.102: v21.59,19.18 21.59,5.08 v20.45,3.94
USB_D-  (via drill 0.2)
  Top 0.102: v21.26,18.41 21.18,18.49 R3.1 | v19.3,3.56 19.3,1.33 J1.5
  Bottom 0.102: v21.26,18.41 21.26,5.77 19.3,3.81 v19.3,3.56
V_USB  (via drill 0.2)
  Top 0.102: U2.32 19.38,16.43 v19.43,16.38 | J1.9 18.25,3.22 v18.33,3.3
  Bottom 0.102: v19.43,16.38 19.43,14.31 19.76,13.98 19.76,12.31 19.68,12.23 19.68,4.91 18.33,3.56 v18.33,3.3

### Text on the board
Top: 1
Horz: 2
Vert: 3
Bottom: v10 | 4
tDocu: 0.8mm PCB / 45 degree chamfered edge / Four layer design / ENIG Finish | Priyanka Makin